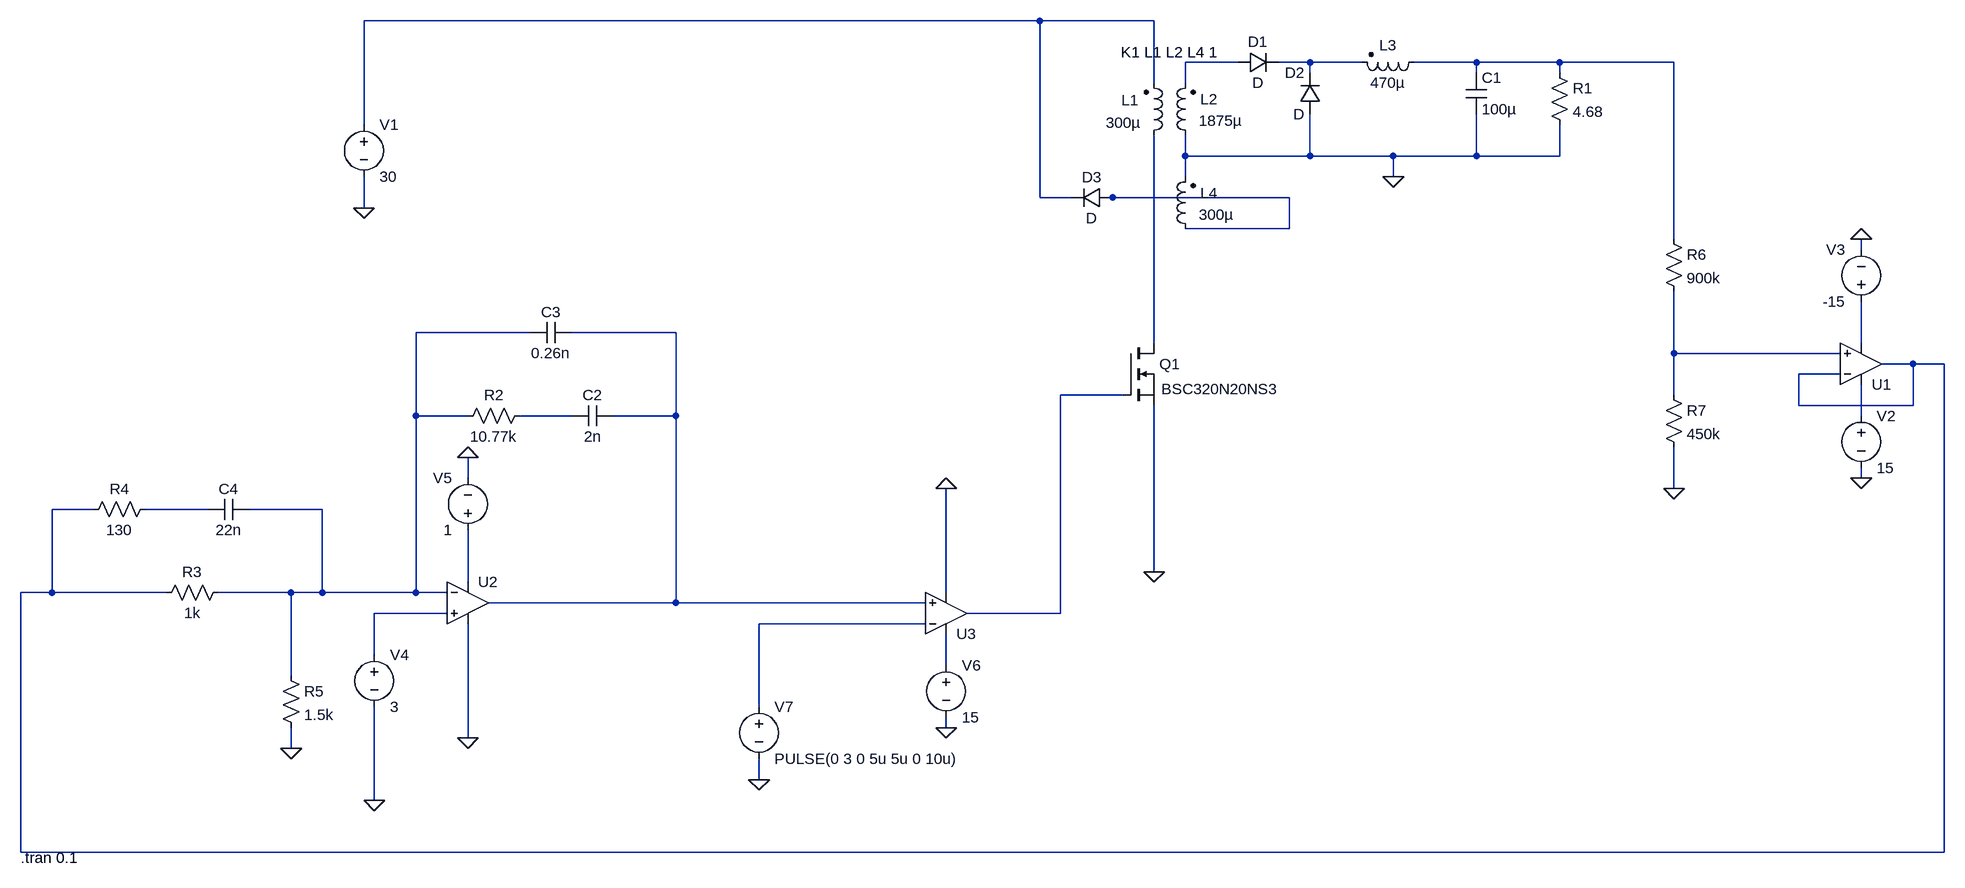
[diagram p0: schematic Forward Converter Compensated.asc]
Forward Converter Compensated.asc, the LTspice schematic file:
Version 4
SHEET 1 1508 952
WIRE 112 -352 -928 -352
WIRE 288 -352 112 -352
WIRE 416 -288 336 -288
WIRE 528 -288 480 -288
WIRE 608 -288 528 -288
WIRE 784 -288 688 -288
WIRE 912 -288 784 -288
WIRE 1088 -288 912 -288
WIRE 528 -272 528 -288
WIRE 784 -272 784 -288
WIRE 912 -272 912 -288
WIRE 288 -256 288 -352
WIRE 336 -256 336 -288
WIRE -928 -192 -928 -352
WIRE 336 -144 336 -176
WIRE 528 -144 528 -208
WIRE 528 -144 336 -144
WIRE 656 -144 528 -144
WIRE 784 -144 784 -208
WIRE 784 -144 656 -144
WIRE 912 -144 912 -192
WIRE 912 -144 784 -144
WIRE 336 -112 336 -144
WIRE 656 -112 656 -144
WIRE 112 -80 112 -352
WIRE 160 -80 112 -80
WIRE 224 -80 208 -80
WIRE 496 -80 224 -80
WIRE -928 -64 -928 -112
WIRE 496 -32 496 -80
WIRE 496 -32 336 -32
WIRE 1088 -16 1088 -288
WIRE 1376 0 1376 -16
WIRE -672 128 -848 128
WIRE -448 128 -608 128
WIRE 288 144 288 -176
WIRE 1376 144 1376 80
WIRE 1088 160 1088 64
WIRE 1344 160 1088 160
WIRE 1456 176 1408 176
WIRE 1504 176 1456 176
WIRE 1344 192 1280 192
WIRE 240 224 144 224
WIRE 1088 224 1088 160
WIRE 1280 240 1280 192
WIRE 1456 240 1456 176
WIRE 1456 240 1280 240
WIRE -848 256 -848 128
WIRE -768 256 -848 256
WIRE -608 256 -688 256
WIRE -448 256 -448 128
WIRE -448 256 -544 256
WIRE 1376 256 1376 208
WIRE -768 352 -768 320
WIRE 1376 352 1376 336
WIRE 1088 368 1088 304
WIRE -1344 400 -1408 400
WIRE -1168 400 -1264 400
WIRE -992 400 -1104 400
WIRE 288 496 288 240
WIRE -768 512 -768 432
WIRE -1408 528 -1408 400
WIRE -1408 528 -1456 528
WIRE -1232 528 -1408 528
WIRE -1040 528 -1152 528
WIRE -992 528 -992 400
WIRE -992 528 -1040 528
WIRE -848 528 -848 256
WIRE -848 528 -992 528
WIRE -800 528 -848 528
WIRE -32 528 -32 368
WIRE -448 544 -448 256
WIRE -448 544 -736 544
WIRE -64 544 -448 544
WIRE -800 560 -912 560
WIRE 144 560 144 224
WIRE 144 560 0 560
WIRE -64 576 -320 576
WIRE -912 624 -912 560
WIRE -32 640 -32 592
WIRE -1040 656 -1040 528
WIRE -320 704 -320 576
WIRE -32 736 -32 720
WIRE -768 752 -768 576
WIRE -1040 768 -1040 736
WIRE -320 816 -320 784
WIRE -912 848 -912 704
WIRE -1456 928 -1456 528
WIRE 1504 928 1504 176
WIRE 1504 928 -1456 928
FLAG -928 -64 0
FLAG 656 -112 0
FLAG 288 496 0
FLAG 1376 352 0
FLAG 1376 -16 0
FLAG -912 848 0
FLAG -768 752 0
FLAG -768 320 0
FLAG -32 736 0
FLAG -32 368 0
FLAG -320 816 0
FLAG -1040 768 0
FLAG 1088 368 0
SYMBOL voltage -928 -208 R0
WINDOW 123 0 0 Left 0
WINDOW 39 0 0 Left 0
SYMATTR InstName V1
SYMATTR Value 30
SYMBOL ind2 272 -160 M180
WINDOW 0 -7 70 Right 2
WINDOW 3 -4 35 Right 2
SYMATTR InstName L1
SYMATTR Value 300µ
SYMATTR Type ind
SYMATTR SpiceLine Rser=0.05
SYMBOL ind2 352 -160 R180
WINDOW 0 -7 71 Right 2
WINDOW 3 -5 38 Right 2
SYMATTR InstName L2
SYMATTR Value 1875µ
SYMATTR Type ind
SYMATTR SpiceLine Rser=0.06
SYMBOL nmos 240 144 R0
WINDOW 3 59 71 Left 2
SYMATTR Value BSC320N20NS3
SYMATTR InstName Q1
SYMBOL diode 416 -272 R270
WINDOW 0 32 32 VTop 2
WINDOW 3 0 32 VBottom 2
SYMATTR InstName D1
SYMBOL diode 544 -208 R180
WINDOW 0 24 64 Left 2
WINDOW 3 24 0 Left 2
SYMATTR InstName D2
SYMBOL ind2 704 -304 R90
WINDOW 0 5 56 VBottom 2
WINDOW 3 32 56 VTop 2
SYMATTR InstName L3
SYMATTR Value 470µ
SYMATTR Type ind
SYMATTR SpiceLine Rser=11.5m
SYMBOL res 896 -288 R0
SYMATTR InstName R1
SYMATTR Value 4.68
SYMBOL cap 768 -272 R0
SYMATTR InstName C1
SYMATTR Value 100µ
SYMATTR SpiceLine Rser=0.05
SYMBOL diode 224 -96 R90
WINDOW 0 0 32 VBottom 2
WINDOW 3 32 32 VTop 2
SYMATTR InstName D3
SYMBOL ind2 352 -16 R180
WINDOW 0 -7 71 Right 2
WINDOW 3 -5 38 Right 2
SYMATTR InstName L4
SYMATTR Value 300µ
SYMATTR Type ind
SYMATTR SpiceLine Rser=0.05
SYMBOL Opamps\\UniversalOpamp2 1376 176 M180
SYMATTR InstName U1
SYMBOL voltage 1376 240 R0
WINDOW 123 0 0 Left 0
WINDOW 39 0 0 Left 0
SYMATTR InstName V2
SYMATTR Value 15
SYMBOL voltage 1376 96 R180
WINDOW 0 24 96 Left 2
WINDOW 3 24 16 Left 2
WINDOW 123 0 0 Left 0
WINDOW 39 0 0 Left 0
SYMATTR InstName V3
SYMATTR Value -15
SYMBOL Opamps\\UniversalOpamp2 -768 544 R0
SYMATTR InstName U2
SYMBOL voltage -912 608 R0
WINDOW 123 0 0 Left 0
WINDOW 39 0 0 Left 0
SYMATTR InstName V4
SYMATTR Value 3
SYMBOL voltage -768 448 R180
WINDOW 0 24 96 Left 2
WINDOW 3 24 16 Left 2
WINDOW 123 0 0 Left 0
WINDOW 39 0 0 Left 0
SYMATTR InstName V5
SYMATTR Value 1
SYMBOL res -672 240 R90
WINDOW 0 0 56 VBottom 2
WINDOW 3 32 56 VTop 2
SYMATTR InstName R2
SYMATTR Value 10.77k
SYMBOL cap -544 240 R90
WINDOW 0 0 32 VBottom 2
WINDOW 3 32 32 VTop 2
SYMATTR InstName C2
SYMATTR Value 2n
SYMBOL cap -608 112 R90
WINDOW 0 0 32 VBottom 2
WINDOW 3 32 32 VTop 2
SYMATTR InstName C3
SYMATTR Value 0.26n
SYMBOL res -1136 512 R90
WINDOW 0 0 56 VBottom 2
WINDOW 3 32 56 VTop 2
SYMATTR InstName R3
SYMATTR Value 1k
SYMBOL res -1248 384 R90
WINDOW 0 0 56 VBottom 2
WINDOW 3 32 56 VTop 2
SYMATTR InstName R4
SYMATTR Value 130
SYMBOL cap -1104 384 R90
WINDOW 0 0 32 VBottom 2
WINDOW 3 32 32 VTop 2
SYMATTR InstName C4
SYMATTR Value 22n
SYMBOL Opamps\\UniversalOpamp2 -32 560 M180
SYMATTR InstName U3
SYMBOL voltage -32 624 R0
WINDOW 123 0 0 Left 0
WINDOW 39 0 0 Left 0
SYMATTR InstName V6
SYMATTR Value 15
SYMBOL voltage -320 688 R0
WINDOW 123 0 0 Left 0
WINDOW 39 0 0 Left 0
SYMATTR InstName V7
SYMATTR Value PULSE(0 3 0 5u 5u 0 10u)
SYMBOL res -1056 640 R0
SYMATTR InstName R5
SYMATTR Value 1.5k
SYMBOL res 1072 -32 R0
SYMATTR InstName R6
SYMATTR Value 900k
SYMBOL res 1072 208 R0
SYMATTR InstName R7
SYMATTR Value 450k
TEXT 312 -288 Bottom 2 !K1 L1 L2 L4 1
TEXT -1456 936 Left 2 !.tran 0.1

The netlist it stands for:
* Forward Converter Compensated.asc
V1 N001 0 30
L1 N008 N001 300µ Rser=0.05
L2 0 N002 1875µ Rser=0.06
M§Q1 N008 N012 0 0 BSC320N20NS3
D1 N002 N003 D
D2 0 N003 D
L3 N004 N003 470µ Rser=11.5m
R1 N004 0 4.68
C1 N004 0 100µ Rser=0.05
D3 N005 N001 D
L4 N005 0 300µ Rser=0.05
XU1 N010 N011 N014 N009 N011 level.2 Avol=1Meg GBW=10Meg Slew=10Meg ilimit=25m rail=0 Vos=0 phimargin=45 en=0 enk=0 in=0 ink=0 Rin=500Meg  ; pins IN+ IN- V+ V- OUT
V2 N014 0 15
V3 N009 0 -15
XU2 N017 N006 N016 0 N007 level.2 Avol=1Meg GBW=10Meg Slew=10Meg ilimit=25m rail=0 Vos=0 phimargin=45 en=0 enk=0 in=0 ink=0 Rin=500Meg  ; pins IN+ IN- V+ V- OUT
V4 N017 0 3
V5 N016 0 1
R2 N013 N006 10.77k
C2 N007 N013 2n
C3 N007 N006 0.26n
R3 N006 N011 1k
R4 N015 N011 130
C4 N006 N015 22n
XU3 N007 N018 N019 0 N012 level.2 Avol=1Meg GBW=10Meg Slew=10Meg ilimit=25m rail=0 Vos=0 phimargin=45 en=0 enk=0 in=0 ink=0 Rin=500Meg  ; pins IN+ IN- V+ V- OUT
V6 N019 0 15
V7 N018 0 PULSE(0 3 0 5u 5u 0 10u)
R5 N006 0 1.5k
R6 N004 N010 900k
R7 N010 0 450k
.model D D
.lib standard.dio
.model NMOS NMOS
.model PMOS PMOS
.lib standard.mos
K1 L1 L2 L4 1
.tran 0.1
.lib UniversalOpamps2.sub
.backanno
.end